# EAGLE design SW3S (EAGLE 7.5.0)
REVISION: A
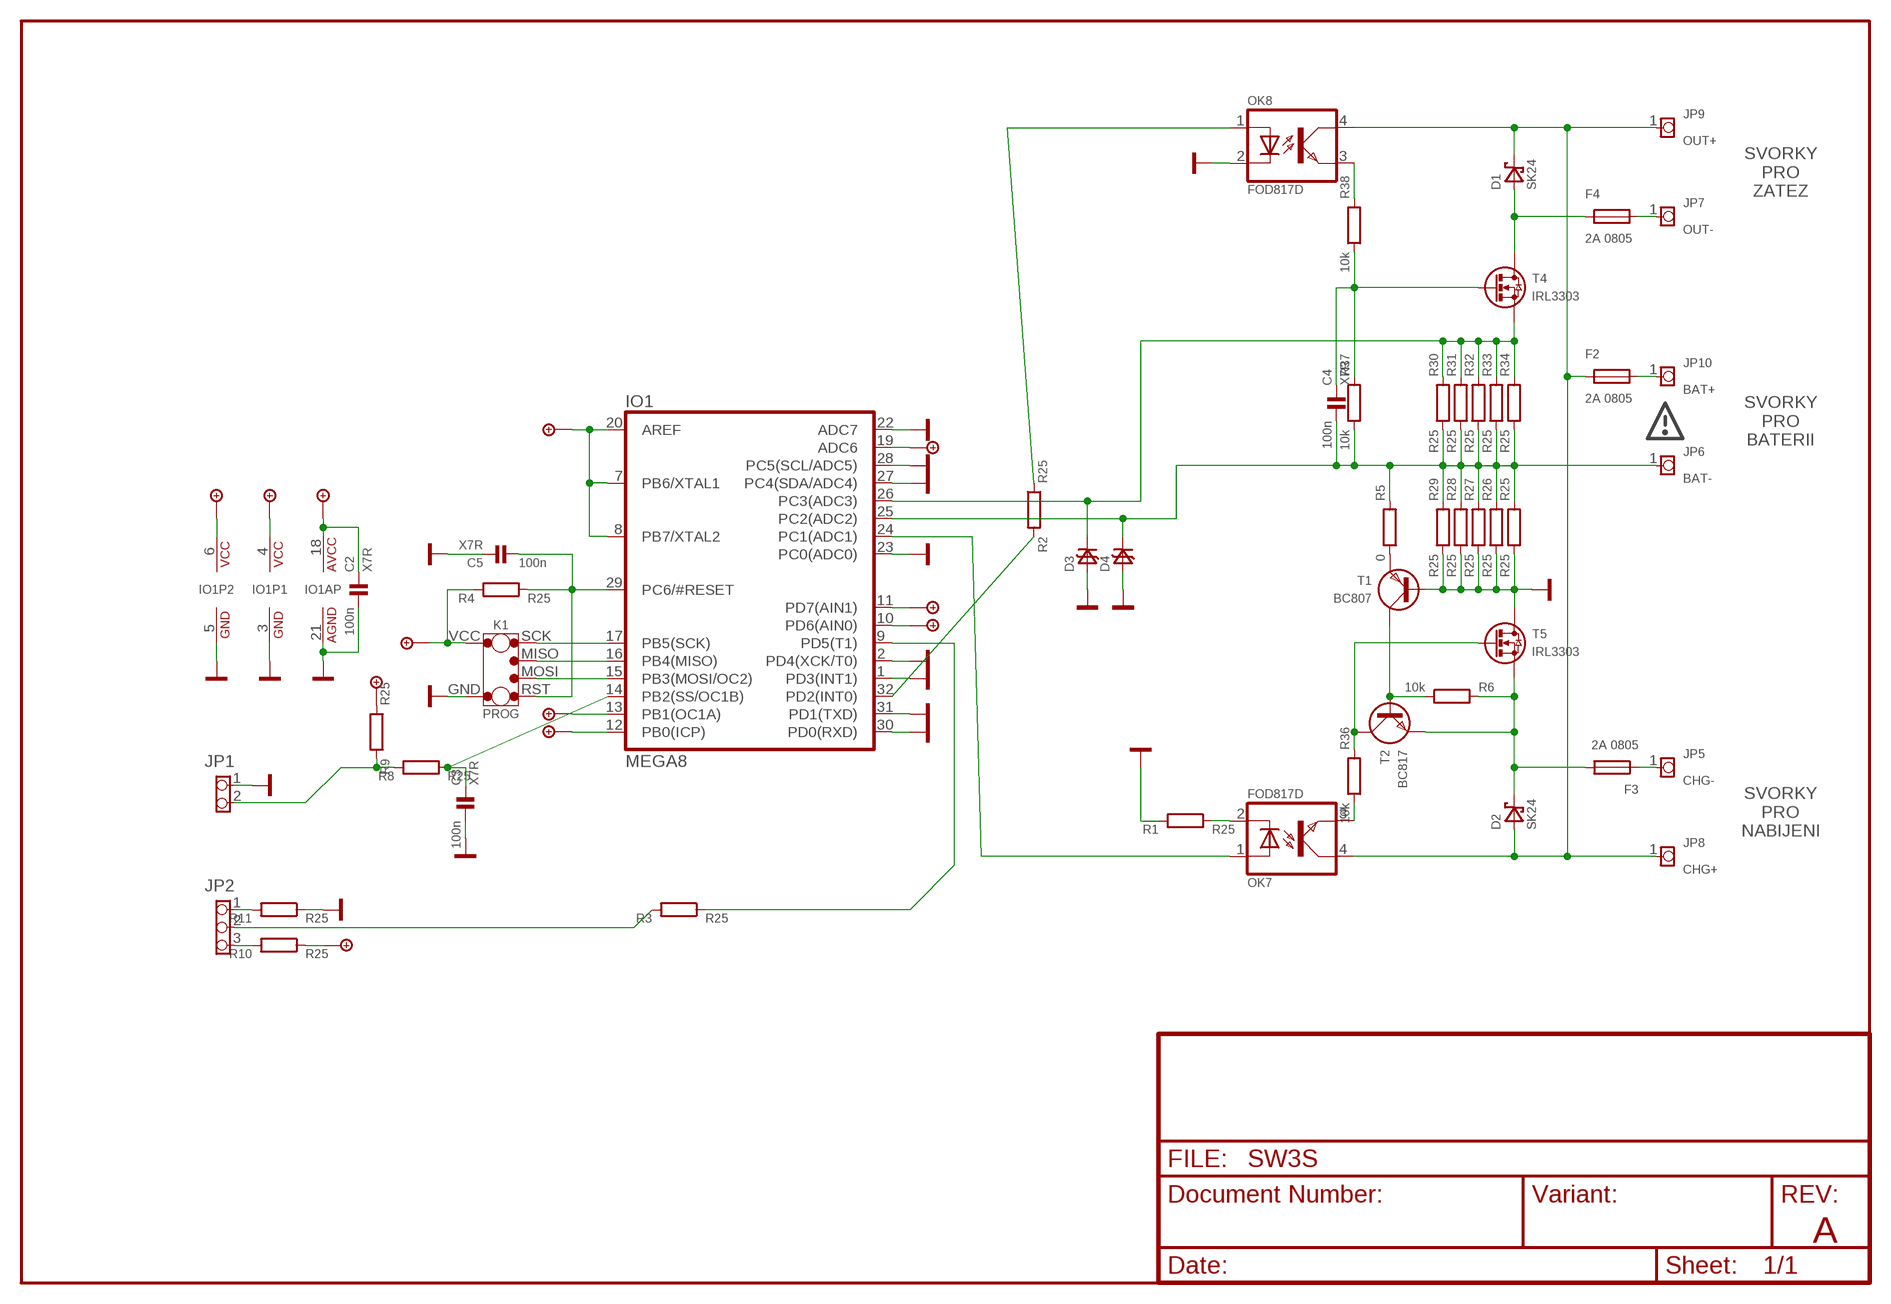
[diagram p0: schematic, sheet 1]

## Parts
C2  100n  C0805  [0805]
C3  100n  C0805  [0805]
C4  100n  C0805  [0805]
C5  100n  C0805  [0805]
D1  SK24  D_SCHOTKY_SMB  [D_SMB]
D2  SK24  D_SCHOTKY_SMB  [D_SMB]
D3  D_TRANSIL_MLL34  [D_MLL34]
D4  D_TRANSIL_MLL34  [D_MLL34]
F2  2A 0805  F_0805  [0805]
F3  2A 0805  F_0805  [0805]
F4  2A 0805  F_0805  [0805]
IO1  MEGA8  [TQFP32]
JP1  PINHD-1X2_254_EDGE  [1X02_254_EDGE]
JP2  PINHD-1X3_254_EDGE  [1X03_254_EDGE]
JP5  CHG-  PINHD-1X1_254_PAD  [1X01_254_PAD]
JP6  BAT-  PINHD-1X1_254_PAD  [1X01_254_PAD]
JP7  OUT-  PINHD-1X1_254_PAD  [1X01_254_PAD]
JP8  CHG+  PINHD-1X1_254_PAD  [1X01_254_PAD]
JP9  OUT+  PINHD-1X1_254_PAD  [1X01_254_PAD]
JP10  BAT+  PINHD-1X1_254_PAD  [1X01_254_PAD]
K1  PROG  [PROG]
OK7  FOD817D  OC_T_NOBASE  [SO04]
OK8  FOD817D  OC_T_NOBASE  [SO04]
R1  R25  R_R0805  [0805]
R2  R25  R_R0805  [0805]
R3  R25  R_R0805  [0805]
R4  R25  R_R0805  [0805]
R5  0  R_R0805  [0805]
R6  10k  R_R0805  [0805]
R8  R25  R_R0805  [0805]
R9  R25  R_R0805  [0805]
R10  R25  R_R0805  [0805]
R11  R25  R_R0805  [0805]
R25  R25  R_R0805  [0805]
R26  R25  R_R0805  [0805]
R27  R25  R_R0805  [0805]
R28  R25  R_R0805  [0805]
R29  R25  R_R0805  [0805]
R30  R25  R_R0805  [0805]
R31  R25  R_R0805  [0805]
R32  R25  R_R0805  [0805]
R33  R25  R_R0805  [0805]
R34  R25  R_R0805  [0805]
R36  10k  R_R0805  [0805]
R37  10k  R_R0805  [0805]
R38  10k  R_R0805  [0805]
T1  BC807  _PNP_SOT23_BCE  [SOT23]
T2  BC817  _NPN_SOT23_BCE  [SOT23]
T4  IRL3303  _EMOS_N_TO252_GDS  [TO252]
T5  IRL3303  _EMOS_N_TO252_GDS  [TO252]

## Nets
+5V: C2.1 IO1.4(VCC) IO1.6(VCC) IO1.7(PB6/XTAL1) IO1.8(PB7/XTAL2) IO1.10(PD6(AIN0)) IO1.11(PD7(AIN1)) IO1.12(PB0(ICP)) IO1.13(PB1(OC1A)) IO1.18(VCC) IO1.19(ADC6) IO1.20(AREF) K1.VCC R4.2 R9.1 R10.1
BAT+: F2.2 JP10.1
BAT-: C4.2 D4.K IO1.25(PC2(ADC2)) JP6.1 R5.2 R25.2 R26.2 R27.2 R28.2 R29.2 R30.1 R31.1 R32.1 R33.1 R34.1 R37.1
CHG-: F3.1 JP5.1
GND: C2.2 C3.2 C5.1 D3.A D4.A IO1.1(PD3(INT1)) IO1.2(PD4(XCK/T0)) IO1.3(GND) IO1.5(GND) IO1.21(GND) IO1.22(ADC7) IO1.23(PC0(ADC0)) IO1.27(PC4(SDA/ADC4)) IO1.28(PC5(SCL/ADC5)) IO1.30(PD0(RXD)) IO1.31(PD1(TXD)) JP1.1 K1.GND OK8.2(C) R1.2 R11.1 R25.1 R26.1 R27.1 R28.1 R29.1 T1.1(B) T5.2(D)
N$1: IO1.17(PB5(SCK)) K1.SCK
N$2: IO1.16(PB4(MISO)) K1.MISO
N$3: IO1.15(PB3(MOSI/OC2)) K1.MOSI
N$4: C5.2 IO1.29(PC6/#RESET) K1.RST R4.1
N$6: IO1.32(PD2(INT0)) R2.2
N$7: IO1.9(PD5(T1)) R3.1
N$9: R6.1 T1.2(C) T2.1(B)
N$10: R36.2 T2.2(C) T5.1(G)
N$11: OK7.3(EMIT) R36.1
N$12: IO1.24(PC1(ADC1)) OK7.1(A)
N$13: D2.K F3.2 R6.2 T2.3(E) T5.3(S)
N$14: F4.2 JP7.1
N$15: OK7.2(C) R1.1
N$16: C3.1 IO1.14(PB2(SS/OC1B)) R8.1
N$17: JP1.2 R8.2 R9.2
N$18: JP2.2 R3.2
N$19: JP2.3 R10.2
N$20: JP2.1 R11.2
N$21: R5.1 T1.3(E)
N$42: OK8.1(A) R2.1
N$47: D3.K IO1.26(PC3(ADC3)) R30.2 R31.2 R32.2 R33.2 R34.2 T4.3(S)
N$55: OK8.3(EMIT) R38.2
N$56: C4.1 R37.2 R38.1 T4.1(G)
OUT+: D1.K D2.A F2.1 JP8.1 JP9.1 OK7.4(COL) OK8.4(COL)
OUT-: D1.A F4.1 T4.2(D)

## Notes on the sheet
- SVORKY
  PRO
  ZATEZ
- SVORKY
  PRO
  BATERII
- SVORKY
  PRO
  NABIJENI

## Library data of the parts
C2-C5 = !discrete:C: Kondenzator; MATERIAL: X7R
D1 D2 = !discrete:D_SCHOTKY: Dioda Schottkyho Typ Ur (Urpk] Uf I (Ipk] Pouzdro SD103B 30 V 200 mA DO35 BAT42 30 V 200 mA DO35 BAT43 30 V 200 mA DO35 BAT46 100 V 150 mA DO35 BAT47 20 V 350 mA DO35 BAT48 40 V 350 mA DO35 SK24 40 V (28V) 0.55V 2A (50A) DO214AA (SMB) SK26 60 V 0.65V 2A (50A) DO214AA (SMB)
D3 D4 = !discrete:D_TRANSIL: Transil Jednosmerny Typ Urm @ Irm Ubr @ Ibr Ucl @ Ipp Pouzdro SM6T30A 25.6V (1uA) 30V (1mA) 53V (75A) DO214AA (SMB)
F2-F4 = !discrete:F: Pojistka
IO1 = !ic_avr:MEGA8
JP1 = !pinhead:PINHD-1X2: Konektor Typ Rastr Imax Umax Rmax Kontakt 2.54 mm 500 mA 125 V 50 mOhm krimp /90 2.54 mm 500 mA 125 V 50 mOhm krimp _MX5267 2.50 mm 2.5 A 250 V 20 mOhm krimp _MX53048 1.25 mm 800 mA 125 V 20 mOhm krimp _PV-3.81 3.81 mm 8 A 130 V 30 mOhm ?roub
JP2 = !pinhead:PINHD-1X3: Konektor 3 PIN Typ Rastr Imax Umax Rmax Kontakt 2.54 mm 500 mA 125 V 50 mOhm krimp /90 2.54 mm 500 mA 125 V 50 mOhm krimp _MX5267 2.50 mm 2.5 A 250 V 20 mOhm krimp _MX53048 1.25 mm 800 mA 125 V 20 mOhm krimp _PV-3.81 3.81 mm 8 A 130 V 30 mOhm ?roub
JP5-JP10 = !pinhead:PINHD-1X1: Konektor Typ Rastr Imax Umax Rmax Kontakt 2.54 mm 500 mA 125 V 50 mOhm krimp /90 2.54 mm 500 mA 125 V 50 mOhm krimp _MX5267 2.50 mm 2.5 A 250 V 20 mOhm krimp _MX53048 1.25 mm 800 mA 125 V 20 mOhm krimp _PV-3.81 3.81 mm 8 A 130 V 30 mOhm sroub WAGO25x 5.08 mm 16 A 250 VAC - pero WAGO25x 7.62 mm 16 A 380 VAC - pero WAGO25x 10.16 mm 16 A 500 VAC - pero
K1 = !konektor:PROG
OK7 OK8 = !opto:OC_T_NOBASE: Optoclen T bez baze Typ CTR Uiz If Uce Ic Pouzdro PC 111 >50 % 5 kV 5 mA 35 V 50 mA O6 PC 817 >50 % 5 kV 5 mA 35 V 50 mA O2 FOD817 50-600 % 5 kV ? 70 V 50 mA O2 SFH 611-3 100-200 % 2,8 kV 10 mA 70 V 50 mA O3 TLP 124 100-200 % 3,7 kV 50 mA 80 V 50 mA O2
R1-R6 R8-R11 R25-R34 R36-R38 = !discrete:R_: Rezistor
T1 = !transistor:_PNP_: Tranzistor PNP Typ [komplement] Uce0 Ic0 Pt h21 Pouzdro BC807 [BC817] 45 V 500 mA 300 mW 100-600 SOT23_BCE BC556 65 V 100 mA 500 mW 120-450 TO92_EBC BC558, BC559 30 V 100 mA 500 mW 200-800 TO92_EBC BC557, BC560 45 V 100 mA 500 mW 200-800 TO92_EBC BC161, KF517 60 V 1 A 750 mW TO39 EBC 2a BC327 45 V 500 mA 625 mW TO92_EBC
T2 = !transistor:_NPN_: Tranzistor NPN Typ [Komplement] Uce0 Ic0 Pt h21 Pouzdro BC817 [BC807] 45 V 500 mA 250 mW 100-600 SOT23_BCE BCX56 [BCX53] 80 V 1 A 1.3 W 60-250 SOT89_BCE BC546 65 V 100 mA 500 mW 120-450 TO92_EBC BC548, BC549 30 V 100 mA 500 mW 200-800 TO92_EBC BC547, BC550 45 V 100 mA 500 mW 200-800 TO92_EBC BC337 45 V 500 mA 625 mW TO92_EBC BC338 25 V 500 mA 625 mW TO92_EBC BC368 20 V 1 A 800 mW TO92_BCE BD317 100 V 16 A 200 W - TO3 BCP56 80 V 1 A 1.35 W 63-250 SOT223_BCEC
T4 T5 = !transistor:_EMOS_N_: Tranzistor MOSFET - ENHANCED s N kanalem Typ UgsT Uds Id0 Pt rdson Pouzdro BS170 3V 60 V 500 mA 350 mW 1,8 - 5,0 Ohm TO92_SGD IRFZ44N 4V 55 V 49 A 110 W 22 mOhm TO220_GDS IRLR110 2V 100 V 4,3 A 25 W(2.5W) 540 mOhm TO252_GDS IRFP260N 4V 200 V 50 A 300 W 40 mOhm TO247AC_GDS BSS138 1.5V 50 V 220 mA 360 mW 5.8 Ohm SOT23_GDS BSS123 2V 50 V 170 mA 360 mW 10 Ohm SOT23_GDS IRLML6246 [kompl. 2246] 1.1V 30 V 5 A 360 mW 30 mOhm SOT23_GDS

## Board
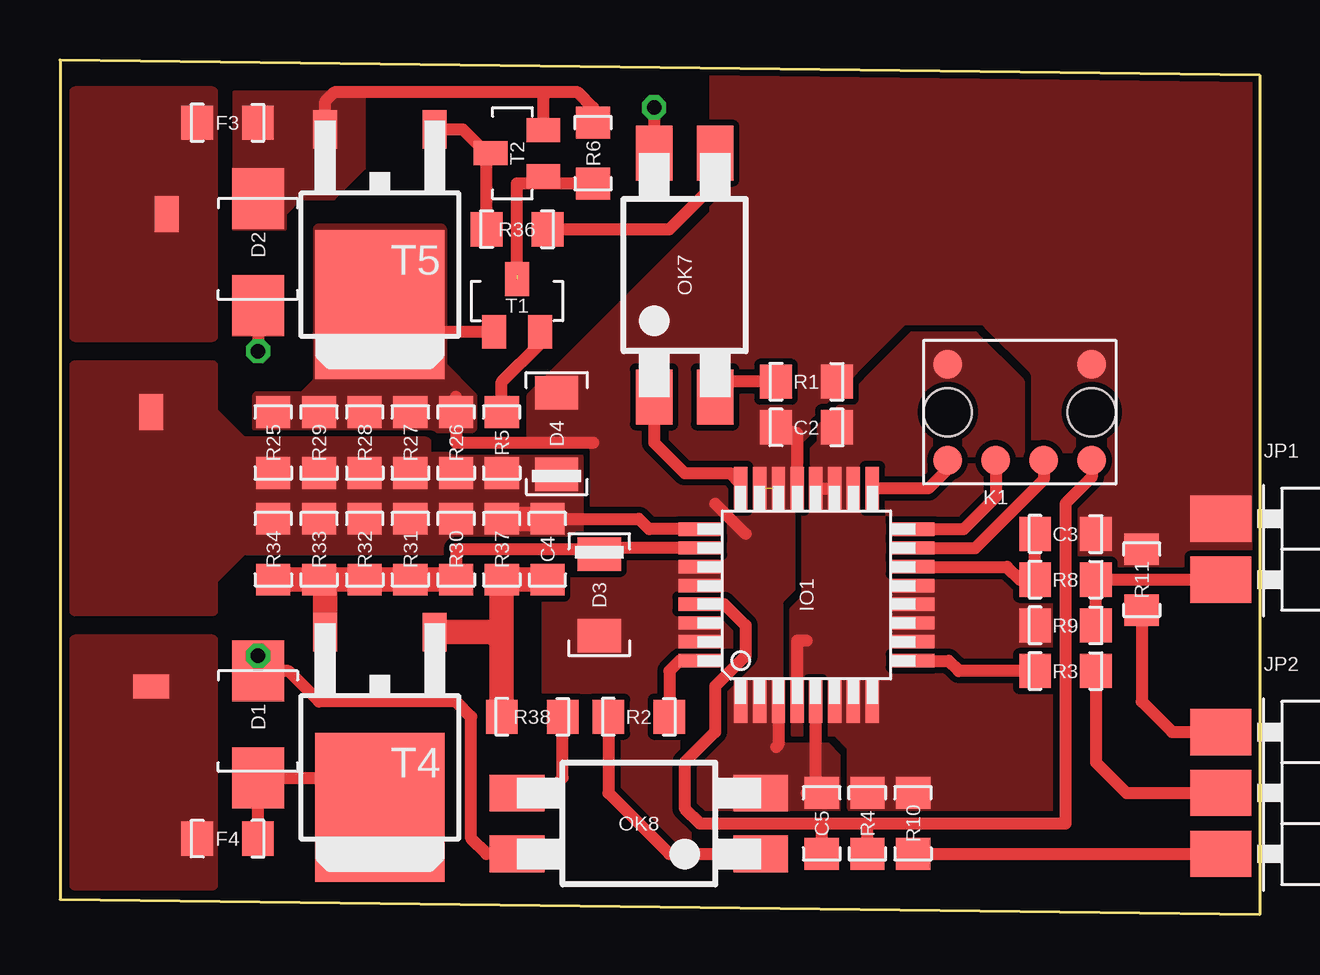
[diagram p1: board, top side]
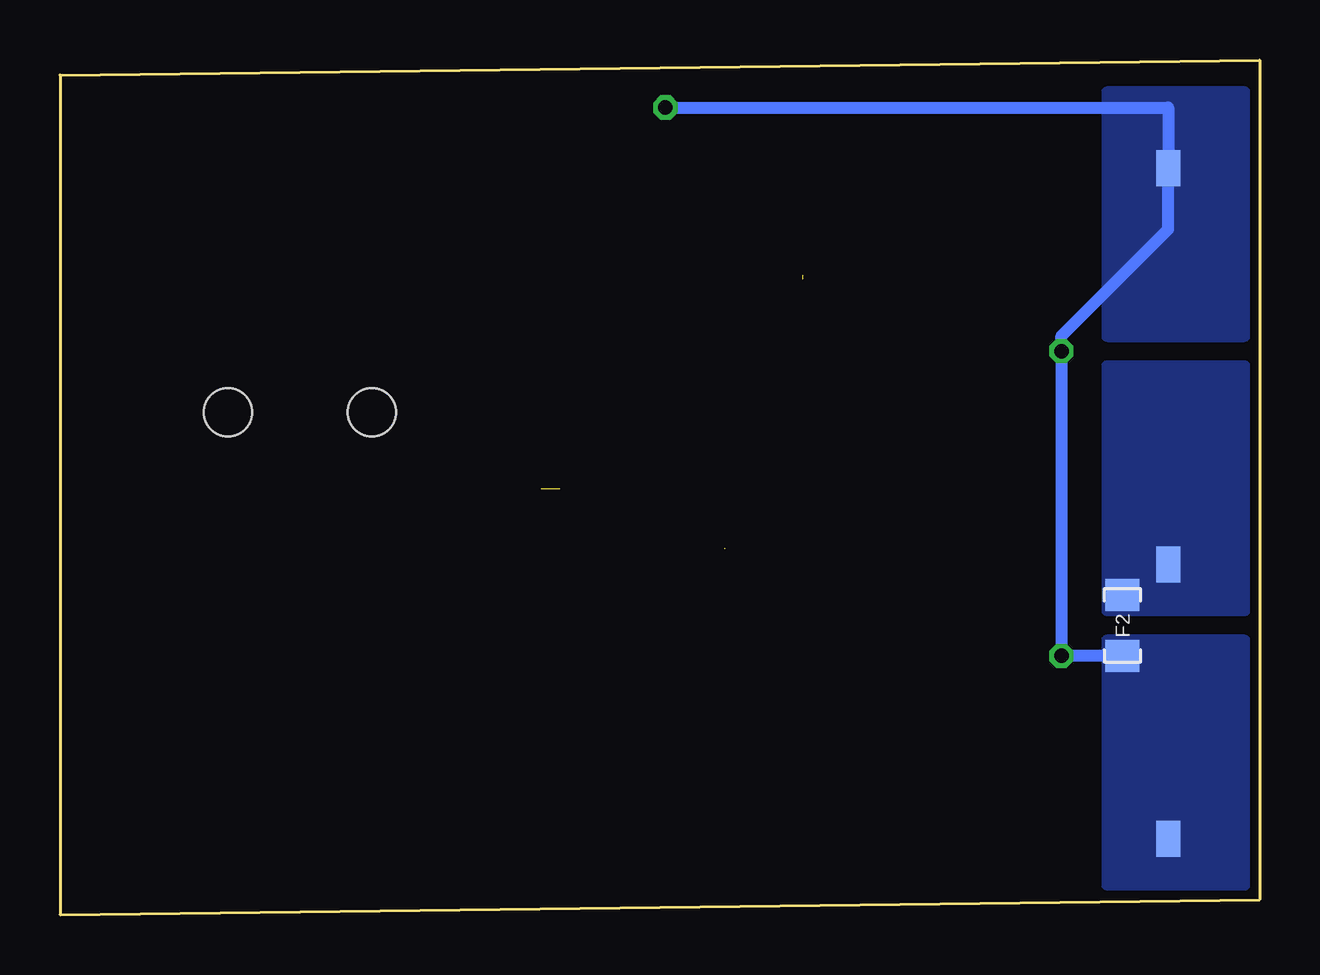
[diagram p2: board, bottom side, seen from below]

Size 50 x 35.63 mm. Coordinates in mm from the lower left corner, seen from the top.
Outline: 0,35.63 0,0.64 50,0 50,35 0,35.63
Copper layers (1*16): Top 0.035mm / dielectric 1.5mm / Bottom 0.035mm
Design rules "default *": minimum track width 10mil, minimum drill 24mil, track to track 8mil, track to pad 8mil, pad to pad 8mil, via to via 8mil, smd to smd 8mil, copper to edge 1mil, drill to drill 1mil, minimum pad ring 10mil, minimum via ring 8mil, stop-mask expansion 4mil, vias tented up to drill 0mil, thermal gap 10mil

### Footprints (pad centres in the part's own frame; a part is rotated, then mirrored left to right if it is on the bottom)
0805 = smd 1.321 x 1.422: 1 -1.27,0; 2 1.27,0
D_SMB = smd 2.54 x 2.159: A 2.54,0; K -1.905,0
D_MLL34 = smd 1.4 x 1.8: A 1.7,0; K -1.7,0
TQFP32 = smd 1.778 x 0.559: 1 -4.445,2.743; 2 -4.445,1.956; 3 -4.445,1.168; 4 -4.445,0.381; 5 -4.445,-0.381; 6 -4.445,-1.168; 7 -4.445,-1.956; 8 -4.445,-2.743; 17 4.445,-2.743; 18 4.445,-1.956; 19 4.445,-1.168; 20 4.445,-0.381; 21 4.445,0.381; 22 4.445,1.168; 23 4.445,1.956; 24 4.445,2.743 | smd 0.559 x 1.778: 9 -2.743,-4.445; 10 -1.956,-4.445; 11 -1.168,-4.445; 12 -0.381,-4.445; 13 0.381,-4.445; 14 1.168,-4.445; 15 1.956,-4.445; 16 2.743,-4.445; 25 2.743,4.445; 26 1.956,4.445; 27 1.168,4.445; 28 0.381,4.445; 29 -0.381,4.445; 30 -1.168,4.445; 31 -1.956,4.445; 32 -2.743,4.445
1X02_254_EDGE = smd 1.93 x 2.54: 1 0,-1.778; 2 2.54,-1.778
1X03_254_EDGE = smd 1.93 x 2.54: 1 -2.54,-1.778; 2 0,-1.778; 3 2.54,-1.778
1X01_254_PAD = smd 1 x 1.5: 1 0,0
PROG = smd 1.2 x 1.2: GND 2,-3; MISO -2,1; MOSI -2,-1; RST -2,-3; SCK -2,3; VCC 2,3 | hole 2: 0,3; 0,-3
SO04 = smd 2.286 x 1.524: 1 -5.08,1.27; 2 -5.08,-1.27; 3 5.08,-1.27; 4 5.08,1.27
SOT23 = smd 1 x 1.4: 1 -0.95,-1.1; 2 0,1.1; 3 0.95,-1.1
TO252 = smd 1 x 1.6: 1 -2.28,-4.8; 3 2.28,-4.8 | smd 5.4 x 6.2: 2 0,2.5

### Placement (x,y rotation side)
C2  31.11,20.32 180 top
C3  41.91,15.88 0 top
C4  20.32,15.24 90 top
C5  31.75,3.81 270 top
D1  8.26,8.26 270 top
D2  8.26,27.94 270 top
D3  22.48,13.33 270 top
D4  20.7,20.07 90 top
F2  5.71,12.06 90 bottom
F3  6.99,33.02 0 top
F4  6.99,3.17 180 top
IO1  31.11,13.33 90 top
JP1  50.16,16.51 270 top
JP2  50.16,5.08 270 top
JP5  4.45,29.21 180 top
JP6  3.81,20.96 180 top
JP7  3.81,9.53 270 top
JP8  3.81,3.17 180 bottom
JP9  3.81,31.12 180 bottom
JP10  3.81,14.61 180 bottom
K1  40.01,20.96 90 top
OK7  26.04,26.67 90 top
OK8  24.13,3.81 180 top
R1  31.11,22.23 0 top
R2  24.13,8.26 0 top
R3  41.91,10.16 0 top
R4  33.66,3.81 90 top
R5  18.41,19.69 270 top
R6  22.23,31.75 90 top
R8  41.91,13.97 0 top
R9  41.91,12.06 0 top
R10  35.56,3.81 270 top
R11  45.09,13.97 270 top
R25  8.89,19.69 270 top
R26  16.51,19.69 270 top
R27  14.61,19.69 270 top
R28  12.7,19.69 270 top
R29  10.79,19.69 270 top
R30  16.51,15.24 270 top
R31  14.61,15.24 270 top
R32  12.7,15.24 270 top
R33  10.79,15.24 270 top
R34  8.89,15.24 270 top
R36  19.05,28.58 180 top
R37  18.41,15.24 270 top
R38  19.68,8.26 0 top
T1  19.05,25.4 0 top
T2  19.05,31.75 90 top
T4  13.34,6.98 180 top
T5  13.34,27.94 180 top

### Tracks (layer width: path | path; a pad name or v marks a point on that pad's centre or on a via)
+5V
  Top 0.508: IO1.20 IO1.19 | IO1.4 30.73,11.43 31.11,11.43
  pour Top (isolate 0.254, no thermals): 30.61,7.62 30.61,12.7 31.11,13.21 31.11,19.05 31.75,19.69 31.75,20.32 35.56,24.13 38.1,24.13 40.01,22.23 40.01,18.42 41.27,17.15 41.27,4.45 33.02,4.45 33.02,6.98 32.38,7.62
BAT+
  pour Bottom (no thermals): 0.64,22.86 6.35,22.86 6.35,12.7 0.64,12.7
BAT-
  Top 0.508: C4.2 24.13,16.51 24.56,16.08 IO1.25
  Top 1.016: C4.2 R37.1
  pour Top (isolate 0.254, no thermals): 6.35,22.86 0.64,22.86 0.64,12.7 6.35,12.7 6.35,13.97 7.62,15.24 21.59,15.24 21.59,19.05 15.24,19.05 15.24,19.69 7.62,19.69 6.35,20.96
CHG-
  pour Top (no thermals): 6.35,34.29 0.64,34.29 0.64,24.13 6.35,24.13
GND  (1 unrouted)
  Top 0.508: 22.23,12.06 22.23,11.89 | IO1.5 31.5,5.46 31.11,5.08 | 27.3,17.15 28.57,15.88 | IO1.21 30.73,20.07 C2.2 | IO1.3 29.95,7.09 29.84,6.98 | 16.51,21.59 R26.1 16.51,19.69 22.23,19.69 | T1.1 15.41,24.3 15.24,24.13
  pour Top (isolate 0.254, rank 6, no thermals): 20.32,13.33 20.32,0.64 50.16,0.64 50.16,35.56 27.3,35.56 27.3,29.21 19.68,21.59 19.68,13.97
  pour Top (isolate 0.254, rank 6, no thermals): 8.26,20.32 8.26,21.59 10.16,21.59 10.79,22.23 10.79,28.58 15.88,28.58 15.88,22.86 17.14,21.59 17.14,20.32
N$1
  Top 0.508: K1.SCK 37.01,18.59 36.2,17.78 IO1.17
N$2
  Top 0.508: IO1.16 37.67,16.08 39.01,17.42 K1.MISO
N$3
  Top 0.508: K1.MOSI 41.01,18.15 38.15,15.29 IO1.15
N$4
  Top 0.508: 31.75,3.81 26.67,3.81 26.04,4.45 26.04,6.35 27.3,7.62 27.3,9.53 28.57,10.79 28.57,12.06 27.69,12.95 IO1.29 | 31.75,3.81 33.66,3.81 | 33.66,3.81 41.91,3.81 41.91,17.15 43.01,18.24 K1.RST | C5.2 31.75,3.81 | R4.1 33.66,3.81
N$6
  Top 0.508: IO1.32 25.83,10.59 25.4,10.16 R2.2
N$7
  Top 0.508: IO1.9 37.03,10.59 37.47,10.16 R3.1
N$9  (1 unrouted)
  Top 0.508: 19.05,26.67 19.05,30.48 20.32,30.48 | 20.15,30.95 T2.1 20.15,30.65 20.32,30.48 | R6.1 20.32,30.48
N$10
  Top 0.508: R36.2 17.78,31.58 T2.2 17.78,31.75 16.79,32.74 T5.1
N$11
  Top 0.508: R36.1 25.4,28.58 27.3,30.48 OK7.3
N$12
  Top 0.508: OK7.1 24.77,19.69 26.04,18.42 27.94,18.42 28.37,17.98 IO1.24
N$13
  Top 0.508: 20.32,34.29 21.59,34.29 22.23,33.66 R6.2 | 20.32,34.29 11.43,34.29 11.05,33.91 T5.3 | T2.3 20.15,34.12 20.32,34.29
  pour Top (no thermals): 7.24,28.58 9.4,28.58 9.4,29.21 10.03,29.85 11.43,29.85 12.7,31.12 12.7,34.29 7.24,34.29
N$14
  pour Top (no thermals): 6.35,11.43 0.64,11.43 0.64,1.27 6.35,1.27
N$15
  Top 0.508: R1.1 27.94,22.23 OK7.2
N$16
  Top 0.508: IO1.14 39.47,14.5 40.01,13.97 R8.1 C3.1
N$17
  Top 0.508: R9.2 R8.2 JP1.2
N$18
  Top 0.508: R3.2 43.18,6.35 44.45,5.08 JP2.2
N$19
  Top 0.508: R10.2 JP2.3
N$20
  Top 0.508: R11.2 45.09,8.89 46.35,7.62 JP2.1
N$21
  Top 0.508: R5.1 18.41,22.23 20,23.81 T1.3
N$42
  Top 0.508: R2.1 22.86,5.08 25.4,2.54 OK8.1
N$47  (1 unrouted)
  Top 0.508: 9.15,13.71 R34.2 | 22.28,15.29 22.23,15.24 | R30.2 16.51,15.24 22.27,15.24 D3.K 22.73,15.29 IO1.26 | 11.05,13.71 R33.2
  Top 1.016: R30.2 R31.2 R32.2 R33.2 R34.2 | T4.3 11.05,13.71
N$55
  Top 0.508: OK8.3 20.32,5.08 20.95,5.71 R38.2
N$56
  Top 1.016: C4.1 R37.2 18.41,11.43 | R38.1 18.41,11.43 | T4.1 18.06,11.79 18.41,11.43
OUT+  (via drill 0.6)
  Top 0.508: D2.A v8.26,23.5 | v8.26,10.79 D1.K 9.53,10.16 10.79,8.89 16.51,8.89 17.14,8.26 17.14,3.17 17.78,2.54 OK8.4 | v24.77,33.66 OK7.4
  Bottom 0.508: v24.77,33.66 3.81,33.66 JP9.1 3.81,28.58 8.26,24.13 v8.26,23.5 v8.26,10.79 F2.1
  pour Bottom (no thermals): 0.64,11.43 6.35,11.43 6.35,1.27 0.64,1.27
  pour Bottom (no thermals): 0.64,34.29 6.35,34.29 6.35,24.13 0.64,24.13
OUT-
  Top 0.508: F4.1 D1.A 13.34,5.71 T4.2

### Text on the board
tPlace: CHG | BAT | OUT